# Altium schematic sheet BQ25570EVO-206.SchDoc
size Legal; DrawnBy: Daniel Pistorino; SheetNumber: 5; SheetTotal: 5
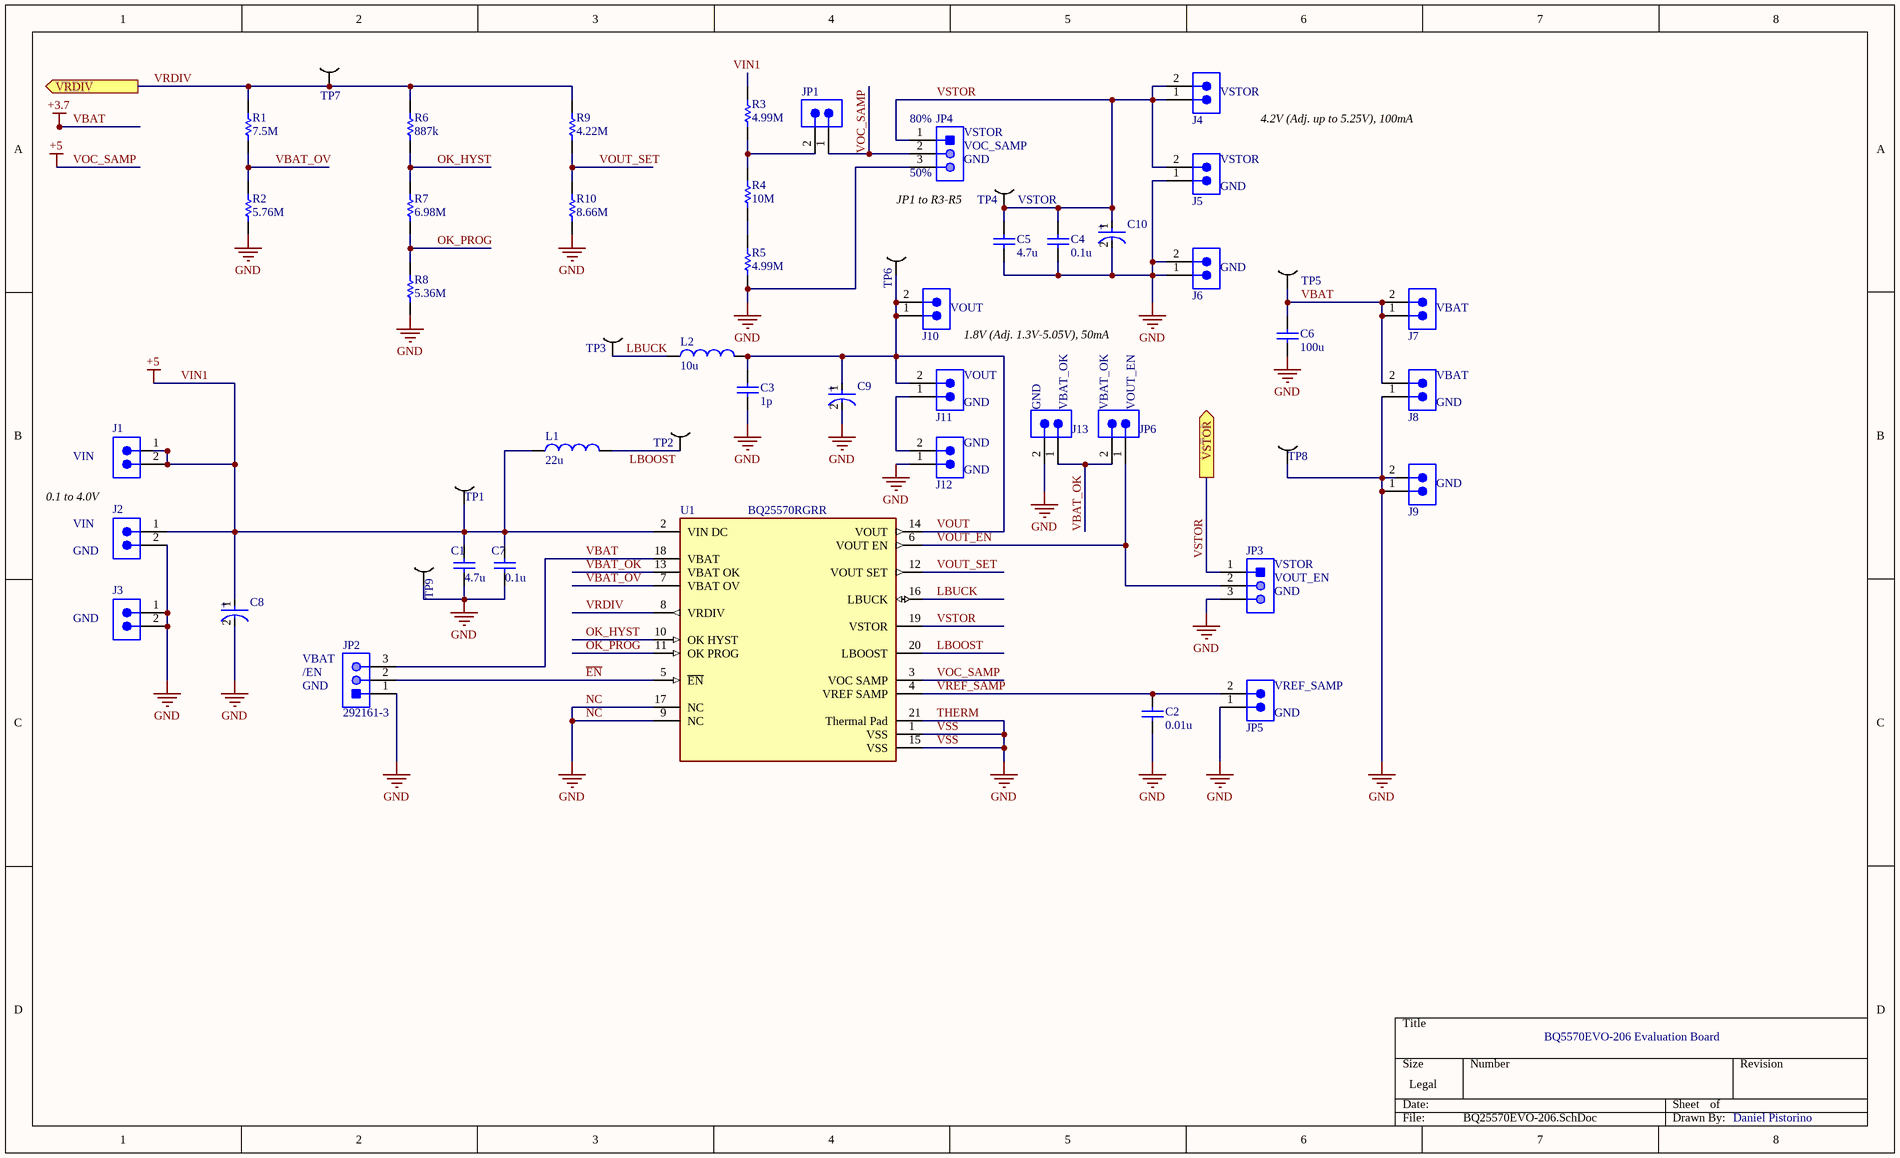
[diagram p0: BQ25570EVO-206.SchDoc]

## Parts
C1  value 4.7u  [0603C]  (hidden comment: 100nF)
C2  0.01u
C3  value 1p  (hidden comment: 22u)
C4  value 0.1u  (hidden comment: Capacitor)
C5  value 4.7u  (hidden comment: Capacitor)
C6  100u
C7  value 0.1u  (hidden comment: Capacitor)
C8  EEEFK1E470P  [FP-FKD-MFG]  (value not drawn)
C9  EEEFK1E470P  [FP-FKD-MFG]  (value not drawn)
C10  EEEFK1E470P  [FP-FKD-MFG]  (value not drawn)
J1  TSW-102-26-F-S  [SMTC-TSW-102-26-XX-S]  (value not drawn)
J2  TSW-102-26-F-S  [SMTC-TSW-102-26-XX-S]  (value not drawn)
J3  TSW-102-26-F-S  [SMTC-TSW-102-26-XX-S]  (value not drawn)
J4  TSW-102-26-F-S  [SMTC-TSW-102-26-XX-S]  (value not drawn)
J5  TSW-102-26-F-S  [SMTC-TSW-102-26-XX-S]  (value not drawn)
J6  TSW-102-26-F-S  [SMTC-TSW-102-26-XX-S]  (value not drawn)
J7  TSW-102-26-F-S  [SMTC-TSW-102-26-XX-S]  (value not drawn)
J8  TSW-102-26-F-S  [SMTC-TSW-102-26-XX-S]  (value not drawn)
J9  TSW-102-26-F-S  [SMTC-TSW-102-26-XX-S]  (value not drawn)
J10  TSW-102-26-F-S  [SMTC-TSW-102-26-XX-S]  (value not drawn)
J11  TSW-102-26-F-S  [SMTC-TSW-102-26-XX-S]  (value not drawn)
J12  TSW-102-26-F-S  [SMTC-TSW-102-26-XX-S]  (value not drawn)
J13  TSW-102-26-F-S  [SMTC-TSW-102-26-XX-S]  (value not drawn)
JP1  TSW-102-26-F-S  [SMTC-TSW-102-26-XX-S]  (value not drawn)
JP2  292161-3  [TECO-292161-3_V]
JP3  292161-3  [TECO-292161-3_V]  (value not drawn)
JP4  292161-3  [TECO-292161-3_V]  (value not drawn)
JP5  TSW-102-26-F-S  [SMTC-TSW-102-26-XX-S]  (value not drawn)
JP6  TSW-102-26-F-S  [SMTC-TSW-102-26-XX-S]  (value not drawn)
L1  22u  [WE-RFI_0805]
L2  10u  [WE-RFI_0805]
R1  7.5M  [0603R]
R2  5.76M  [0603R]
R3  4.99M  [0603R]
R4  10M  [0603R]
R5  4.99M  [0603R]
R6  887k  [0603R]
R7  6.98M  [0603R]
R8  5.36M  [0603R]
R9  4.22M  [0603R]
R10  8.66M  [0603R]
TP1  VIN  [TestPoint]  (value not drawn)  (no BOM)
TP2  TestPoint  [TestPoint]  (value not drawn)  (no BOM)
TP3  TestPoint  [TestPoint]  (value not drawn)  (no BOM)
TP4  VSTOR  [TestPoint]  (no BOM)
TP5  VBAT  [TestPoint]  (value not drawn)  (no BOM)
TP6  Testpoint  [TestPoint]  (value not drawn)  (no BOM)
TP7  TestPoint  [TestPoint]  (value not drawn)  (no BOM)
TP8  TestPoint  [TestPoint]  (value not drawn)  (no BOM)
TP9  TestPoint  [TestPoint]  (value not drawn)  (no BOM)
U1  BQ25570RGRR  [FP-RGR0020A-MFG]

## Ports
VRDIV (out), VSTOR (out)

## Nets
NC: C1.1 C2.1 C3.1 C4.1 C5.1 C6.1 C7.1 C8.2(A) C9.2(A) C10.2(A) J2.2 J3.1 J3.2 J5.1 J6.1 J6.2 J8.1 J9.1 J9.2 J12.1 J13.2 JP2.1 JP3.3 JP4.3 JP5.1 R2.2 R5.2 R8.2 R10.2 TP8.TP? TP9.TP? U1.1(VSS) U1.9(NC) U1.15(VSS) U1.17(NC) U1.21(Thermal_Pad)  [also labelled GND, THERM, VSS]
VBAT: C6.2 J7.1 J7.2 J8.2 JP2.3 TP5.TP? U1.18(VBAT)  [also labelled +3.7]
VIN1: C1.2 C7.2 C8.1(C) J1.1 J1.2 J2.1 JP1.1 JP4.2 L1.1 R3.1 TP1.TP? U1.2(VIN_DC) U1.3(VOC_SAMP)  [also labelled +5, VOC_SAMP]
~{EN}: JP2.2 U1.5(~{EN})
LBOOST: L1.2 TP2.TP? U1.20(LBOOST)
LBUCK: L2.1 TP3.TP? U1.16(LBUCK)
OK_HYST: R6.2 R7.1 U1.10(OK_HYST)
OK_PROG: R7.2 R8.1 U1.11(OK_PROG)
VBAT_OK: J13.1 JP6.2 U1.13(VBAT_OK)
VBAT_OV: R1.2 R2.1 U1.7(VBAT_OV)
VOUT: C3.2 C9.1(C) J10.1 J10.2 J11.2 L2.2 TP6.TP? U1.14(VOUT)
VOUT_EN: JP3.2 JP6.1 U1.6(VOUT_EN)
VOUT_SET: R9.2 R10.1 U1.12(VOUT_SET)
VRDIV: R1.1 R6.1 R9.1 TP7.TP? U1.8(VRDIV) ; port VRDIV
VREF_SAMP: C2.2 JP5.2 U1.4(VREF_SAMP)
VSTOR: C4.2 C5.2 C10.1(C) J4.1 J4.2 J5.2 JP3.1 JP4.1 TP4.TP? U1.19(VSTOR) ; port VSTOR
NetJ11_1: J11.1 J12.2
NetJP1_2: JP1.2 R3.2 R4.1
NetR4_2: R4.2 R5.1

## Notes on the sheet
- (near J4) VSTOR
- (near JP4) 80%
- (near JP4) VSTOR
- (near JP4) VOC_SAMP
- (near JP4) GND
- (near J5) VSTOR
- 4.2V (Adj. up to 5.25V), 100mA
- JP1 to R3-R5
- (near JP4) 50%
- (near J5) GND
- (near J6) GND
- (near J10) VOUT
- 1.8V (Adj. 1.3V-5.05V), 50mA
- (near J7) VBAT
- (near J11) VOUT
- (near J11) GND
- (near J13) GND
- (near J13) VBAT_OK
- (near JP6) VBAT_OK
- (near JP6) VOUT_EN
- (near J8) VBAT
- (near J8) GND
- 0.1 to 4.0V
- (near J1) VIN
- (near J12) GND
- (near J9) GND
- VIN
- GND
- (near JP3) VSTOR
- (near J3) GND
- (near JP3) VOUT_EN
- (near JP3) GND
- (near JP2) VBAT
- (near JP2) /EN
- (near JP2) GND
- (near JP5) VREF_SAMP
- (near JP5) GND
- BQ5570EVO-206 Evaluation Board
- Daniel Pistorino
- (in symbol CMP-05427-000093-1) +

## Library data of the parts
C1 = Cap: Capacitor; Published: 8-Jun-2000; Revision: July-2002: Re-released for DXP Platform.; Publisher: Altium Limited
C2-C7 = Capacitor: SimulationGenericComponent: True
  C2: Value: 0.01u
  C6: Value: 100u
C8-C10 = CMP-05427-000093-1: CAP ALUM 47UF 20% 25V SMD; Polarity: Polar; Leakage Current: 3uA; Ripple Current: 240mA; Impedance: 360mR; Dielectric Material: Aluminium; Life (Hours): 2000Hour; Capacitance: 47uF; Radiation Hardening: No; Termination: SMD/SMT; Height - Seated (Max): 0.24inch; Diameter: 6.3mm; RoHS Compliant: Yes; Voltage Rating: 25V; Ripple Current (AC): 240mA; Tolerance: 20%; Max Operating Temperature: 105°C; Min Operating Temperature: -55°C; Number of Pins: 2; Voltage: 25V; Height: 5.8mm; Series: FK; Width: 7.8mm; REACH SVHC: No SVHC; Construction: Cylindrical; Mount: Surface Mount; Contact Plating: Tin; Length: 5.8mm; Package Quantity: 1000; ESR (Equivalent Series Resistance): 360mR; Lead Free: Lead Free; Voltage Rating (DC): 25V; Packaging: Tape and Reel; Case/Package: Radial
J1-J13 JP1 JP5 JP6 = CMP-1024-00329-1: 0.025" SQ Post Header, Through-hole, Vertical, -55 to 125 degC, 2.54 mm Pitch, 2-Pin, Male, RoHS; Manufacturer: Samtec; Pitch: 2.54 mm; PackageVersion: DM, 8/1988; ComponentLink2Description: Datasheet; PackageReference: TSW-102-26-XX-S; ComponentLink3URL: http://www.samtec.com/documents/webfiles/cpdf/TSW-XXX-XX-XXX-X-XX-XXX-MKT.pdf; ComponentLink2URL: http://www.samtec.com/documents/webfiles/pdf/TSW_TH.PDF; ComponentLink1Description: Manufacturer URL; DatasheetVersion: F-214; RoHS: True; ComponentLink3Description: Package Specification; PartNumber: TSW-102-26-F-S; Temperature Range: -55 to 125 degC; Orientation: Vertical; ComponentLink1URL: http://www.samtec.com; PackageDescription: .025[0.64] SQ. Post Terminal Strip Assembly; Mounting Technology: Through-hole
JP2-JP4 = CMP-2000-05551-1: Male Header, Pitch 2 mm, 1 x 3 Position, Height 6.8 mm, Tail Length 3.2 mm, -40 to 105 degC, RoHS, Bulk; Manufacturer: TE Connectivity; SVHC: NoSVHC(15-Jun-2015); Pitch Spacing: 2mm; Contact Termination Type: ThroughHole; No. of Rows: 1Rows; No. of Contacts: 3Contacts; Product Range: AMPCTSeries; Mounting Technology: ThroughHole; Manufacturer URL: http://www.te.com/; Contact Material: Brass; Datasheet URL: http://www.te.com/commerce/DocumentDelivery/DDEController?Action=showdoc&DocId=Customer+Drawing%7F292161%7FP1%7Fpdf%7FEnglish%7FENG_CD_292161_P1.pdf%7F292161-3; Package Reference: 292161-3; Contact Plating: TinPlatedContacts; Gender: Header; Datasheet Version: Rev. P1, 06/2016; Package Description: Male Header, Pitch 2 mm, 1 x 3 Position, Height 6.8 mm, Tail Length 3.2 mm
L1 L2 = CMP-03913-22866570-2: 744760382A WE-RFI SMT Ferrite Inductor; Tolerance: 5%; Test Frequency: 7.96MHz; Self Resonant Frequency: 40MHz; Q Factor: 15; Inductance: 8.2µH; Max DC Current: 120mA; DC Resistance (DCR): 3.5Ω; Shielding: Unshielded; Termination: SMD/SMT; Min Operating Temperature: -40°C; Height - Seated (Max): 1.4732mm; Case/Package: 0805; Ambient Temperature Range High: 70°C; Width: 1.25mm; Inductance Tolerance: 5%; NexarPartId: 22866570; REACH SVHC: Unknown; RoHS: Compliant; Composition: Wirewound; Mount: Surface Mount; Max Operating Temperature: 85°C; Packaging: Digi-Reel®; Length: 2mm; Height: 1.2mm; Weight: 32.006612mg; Core Material: Ferrite; Ambient Temperature Range Low: -40°C; Current Rating: 120mA
R1-R10 = Res1: Resistor; Value: 1K; Published: 8-Jun-2000; Revision: July-2002: Re-released for DXP Platform.; Publisher: Altium Limited
TP1-TP9 = TP?
U1 = CMP-04911-000040-1: IC ENERGY HARV CTRLR BATT 20VQFN; Operating Supply Current: 488nA; Switching Frequency: 1MHz; Operating Supply Voltage: 4V; Output Current: 100mA; Packaging: Tape and Reel; Lead Free: Lead Free; Contact Plating: Gold; RoHS Compliant: Yes; Mount: Surface Mount; Case/Package: VQFN; Min Operating Temperature: -40°C; Max Operating Temperature: 125°C; Package Quantity: 3000; Number of Pins: 20